# Altium schematic sheet I2C_ISO.SchDoc
size 420 x 297 mm; Organization: Altium Limited; Address1: L3, 12a Rodborough Rd; Address2: Frenchs Forest; Address3: NSW; Address4: Australia 2086
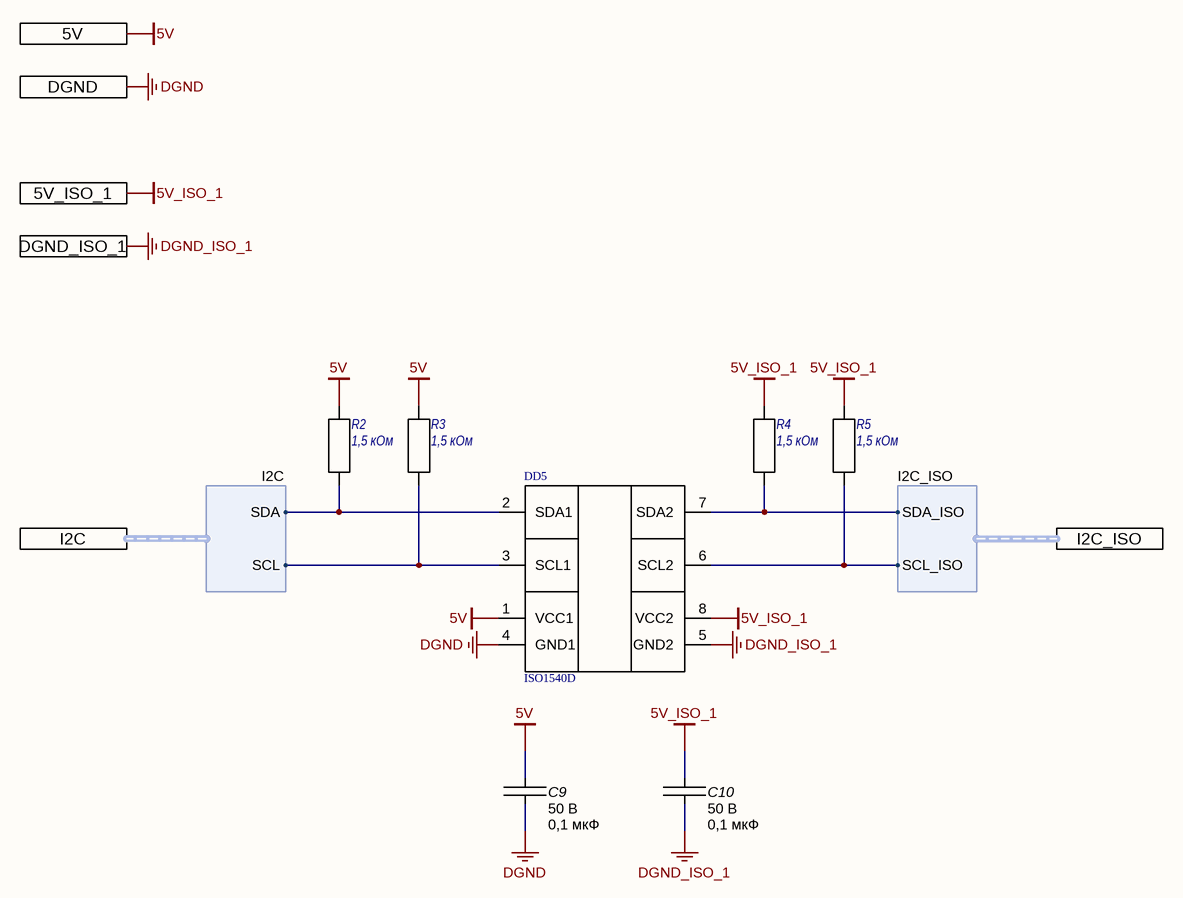
[diagram p0: I2C_ISO.SchDoc]

## Parts
C9  Voltage: 50 В  [C0603C]  (hidden comment: 0,1 мкФ)
C10  Voltage: 50 В  [C0603C]  (hidden comment: 0,1 мкФ)
DD5  ISO1540D  [SOIC-8]
R2  1,5 кОм  [C0603R]
R3  1,5 кОм  [C0603R]
R4  1,5 кОм  [C0603R]
R5  1,5 кОм  [C0603R]

## Ports
5V, 5V_ISO_1, DGND, DGND_ISO_1, I2C (harness I2C), I2C_ISO (harness I2C_ISO)

## Harnesses
I2C: SDA, SCL
I2C_ISO: SDA_ISO, SCL_ISO

## Nets
5V: C9.1 DD5.1(VCC1) R2.2 R3.2 ; port 5V
5V_ISO_1: C10.1 DD5.8(VCC2) R4.2 R5.2 ; port 5V_ISO_1
DGND: C9.2 DD5.4(GND1) ; port DGND
DGND_ISO_1: C10.2 DD5.5(GND2) ; port DGND_ISO_1
NetDD5_2: DD5.2(SDA1) R2.1 ; port I2C.SDA
NetDD5_3: DD5.3(SCL1) R3.1 ; port I2C.SCL
NetDD5_6: DD5.6(SCL2) R5.1 ; port I2C_ISO.SCL_ISO
NetDD5_7: DD5.7(SDA2) R4.1 ; port I2C_ISO.SDA_ISO

## Notes on the sheet
- Подп. и дата
- Инв. № дубл.
- Взам. инв. №
- Инв. № подл.
- Изм.
- Лист
- № докум.
- Подп.
- Дата
- 2.106-A3
- Копировал
- Формат А3

## Library data of the parts
C9 C10 = CC0603KRX7R9BB104: SMD 0603 ; X7R; 0,1 мкФ; 50 В; Manufacturer: YAGEO; Persent: ±5%; Type: Ceramic; Part Number: CC0603KRX7R9BB104; Package: SMD 0603; Dielectric: X7R; ComponentLink1Description: Datasheet; Value: 0,1 мкФ
DD5 = ISO1540D: I2C ISO; Manufacturer: Texas Instruments; Part Number: ISO1540D; Type: ISO
R2-R5 = RC0603FR-071K5L: SMD 0603; 0,1; 1%; 1,5 кОм; Manufacturer: Yageo; Power: 0,1; Part Number: RC0603FR-071K5L; Package: SMD 0603; Persent: 1%; Value: 1,5 кОм; Category: R